# Altium schematic sheet ClockGen.SchDoc
size A
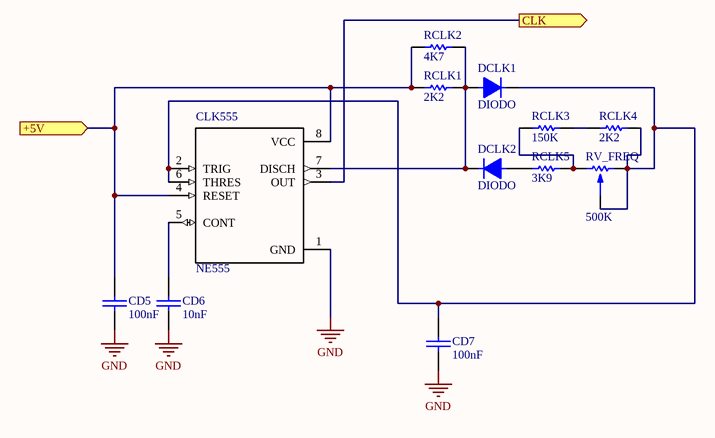
[diagram p0: ClockGen.SchDoc]

## Parts
CD5  100nF  [0805]
CD6  10nF  [0805]
CD7  100nF  [0805]
CLK555  NE555  [*DIP794W45P254L1060H508Q8]
DCLK1  DIODO  [DO41]
DCLK2  DIODO  [DO41]
RCLK1  2K2  [0805]
RCLK2  4K7  [0805]
RCLK3  150K  [0805]
RCLK4  2K2  [0805]
RCLK5  3K9  [0805]
RV_FREQ  500K  [PRESET V]

## Ports
+5V (in), CLK (out)

## Nets
GND: CD5.2 CD6.2 CD7.2 CLK555.1(GND)
+5V: CD5.1 CLK555.4(RESET) CLK555.8(VCC) RCLK1.2 RCLK2.1 ; port +5V
CLK: CLK555.3(OUT) ; port CLK
NetCD6_1: CD6.1 CLK555.5(CONT)
NetCD7_1: CD7.1 CLK555.2(TRIG) CLK555.6(THRES) DCLK1.2 RCLK4.2 RV_FREQ.1 RV_FREQ.2
NetCLK555_7: CLK555.7(DISCH) DCLK1.1 DCLK2.2 RCLK1.1 RCLK2.2
NetDCLK2_1: DCLK2.1 RCLK5.1
NetRCLK3_1: RCLK3.1 RCLK5.2 RV_FREQ.3
NetRCLK3_2: RCLK3.2 RCLK4.1

## Library data of the parts
CD5-CD7 = CAP
CLK555 = NE555: MF: Texas Instruments; Availability: Unavailable; Package: SOIC-8 Conrad; SnapEDA_Link: https://www.snapeda.com/parts/NE555/Texas%20Instruments/view-part/?ref=snap; Price: None; MP: NE555; Value: *
RCLK1-RCLK5 = RES
RV_FREQ = PRESET